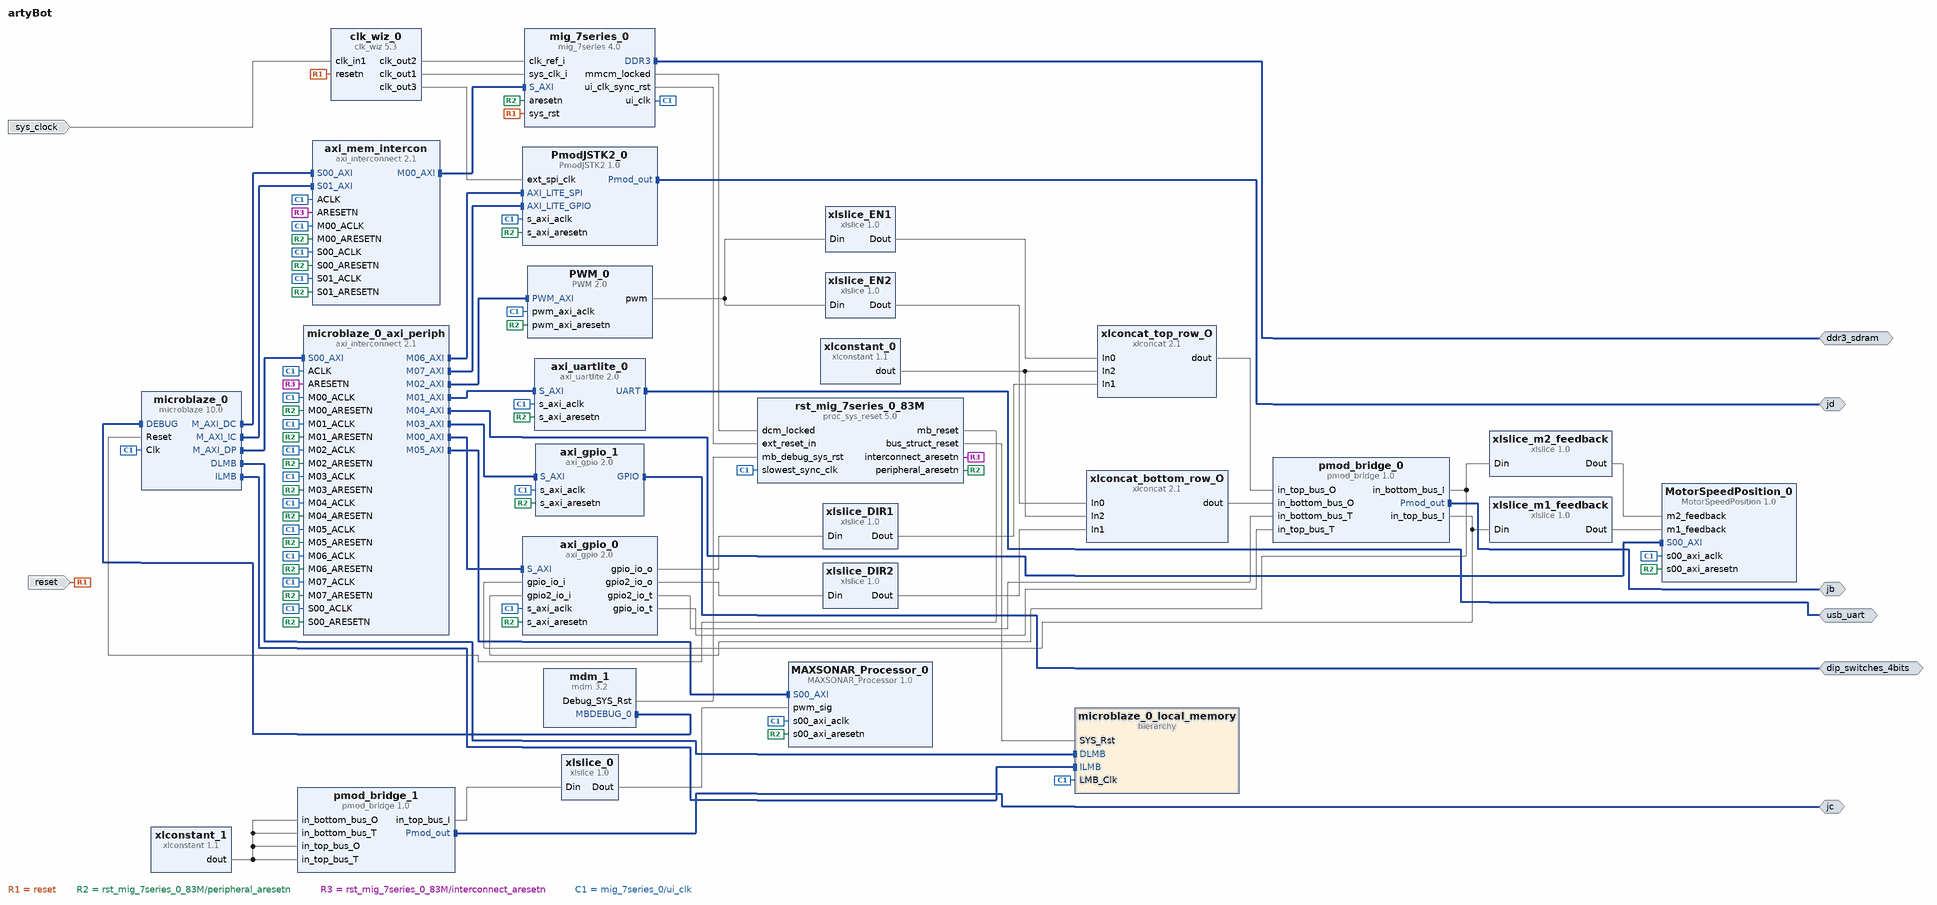
[diagram p0: block diagram of the top level]
# Vivado block design artyBot, xc7a35ticsg324-1L, Vivado 2016.4
create_bd_design artyBot

create_bd_intf_port -mode Master -vlnv xilinx.com:interface:ddrx_rtl:1.0 ddr3_sdram
create_bd_intf_port -mode Master -vlnv xilinx.com:interface:uart_rtl:1.0 usb_uart
create_bd_intf_port -mode Master -vlnv xilinx.com:interface:gpio_rtl:1.0 dip_switches_4bits
create_bd_intf_port -mode Master -vlnv digilentinc.com:interface:pmod_rtl:1.0 jb
create_bd_intf_port -mode Master -vlnv digilentinc.com:interface:pmod_rtl:1.0 jc
create_bd_intf_port -mode Master -vlnv digilentinc.com:interface:pmod_rtl:1.0 jd
create_bd_port -dir I -type rst reset
set_property -dict {CONFIG.POLARITY ACTIVE_LOW} [get_bd_ports reset]
create_bd_port -dir I -type clk sys_clock
set_property -dict {CONFIG.FREQ_HZ 100000000 CONFIG.PHASE 0.000} [get_bd_ports sys_clock]

create_bd_cell -type ip -vlnv xilinx.com:ip:mig_7series:4.0 mig_7series_0
set_property -dict {CONFIG.RESET_BOARD_INTERFACE reset CONFIG.BOARD_MIG_PARAM ddr3_sdram} [get_bd_cells mig_7series_0]
create_bd_cell -type ip -vlnv xilinx.com:ip:microblaze:10.0 microblaze_0
set_property -dict [list \
  CONFIG.C_D_AXI 1 \
  CONFIG.C_D_LMB 1 \
  CONFIG.C_I_LMB 1 \
  CONFIG.C_DEBUG_ENABLED 1 \
  CONFIG.C_USE_ICACHE 1 \
  CONFIG.C_CACHE_BYTE_SIZE 16384 \
  CONFIG.C_USE_DCACHE 1 \
  CONFIG.C_DCACHE_BYTE_SIZE 16384 \
] [get_bd_cells microblaze_0]
create_bd_cell -type hier microblaze_0_local_memory
create_bd_cell -type ip -vlnv xilinx.com:ip:mdm:3.2 mdm_1
create_bd_cell -type ip -vlnv xilinx.com:ip:proc_sys_reset:5.0 rst_mig_7series_0_83M
create_bd_cell -type ip -vlnv xilinx.com:ip:axi_interconnect:2.1 axi_mem_intercon
set_property -dict {CONFIG.NUM_SI 2 CONFIG.NUM_MI 1} [get_bd_cells axi_mem_intercon]
create_bd_cell -type ip -vlnv xilinx.com:ip:axi_interconnect:2.1 microblaze_0_axi_periph
set_property -dict {CONFIG.NUM_MI 8} [get_bd_cells microblaze_0_axi_periph]
create_bd_cell -type ip -vlnv xilinx.com:ip:axi_uartlite:2.0 axi_uartlite_0
set_property -dict {CONFIG.USE_BOARD_FLOW true CONFIG.UARTLITE_BOARD_INTERFACE usb_uart} [get_bd_cells axi_uartlite_0]
create_bd_cell -type ip -vlnv xilinx.com:ip:clk_wiz:5.3 clk_wiz_0
set_property -dict [list \
  CONFIG.CLKOUT2_USED true \
  CONFIG.CLKOUT3_USED true \
  CONFIG.NUM_OUT_CLKS 3 \
  CONFIG.CLKOUT1_REQUESTED_OUT_FREQ 166.667 \
  CONFIG.CLKOUT2_REQUESTED_OUT_FREQ 200 \
  CONFIG.CLKOUT3_REQUESTED_OUT_FREQ 16.000 \
  CONFIG.RESET_PORT resetn \
  CONFIG.MMCM_DIVCLK_DIVIDE 1 \
  CONFIG.MMCM_CLKOUT0_DIVIDE_F 6.000 \
  CONFIG.MMCM_CLKOUT1_DIVIDE 5 \
  CONFIG.MMCM_CLKOUT2_DIVIDE 63 \
  CONFIG.RESET_TYPE ACTIVE_LOW \
  CONFIG.USE_BOARD_FLOW true \
  CONFIG.CLK_IN1_BOARD_INTERFACE sys_clock \
  CONFIG.RESET_BOARD_INTERFACE reset \
  CONFIG.CLKOUT1_JITTER 118.758 \
  CONFIG.CLKOUT2_JITTER 114.829 \
  CONFIG.CLKOUT2_PHASE_ERROR 98.575 \
  CONFIG.CLKOUT3_JITTER 191.683 \
  CONFIG.CLKOUT3_PHASE_ERROR 98.575 \
] [get_bd_cells clk_wiz_0]
create_bd_cell -type ip -vlnv xilinx.com:ip:axi_gpio:2.0 axi_gpio_1
set_property -dict {CONFIG.USE_BOARD_FLOW true CONFIG.GPIO_BOARD_INTERFACE dip_switches_4bits} [get_bd_cells axi_gpio_1]
create_bd_cell -type ip -vlnv xilinx.com:ip:xlconcat:2.1 xlconcat_top_row_O
set_property -dict {CONFIG.NUM_PORTS 3 CONFIG.IN0_WIDTH 1 CONFIG.IN1_WIDTH 1 CONFIG.IN2_WIDTH 2} [get_bd_cells xlconcat_top_row_O]
create_bd_cell -type ip -vlnv xilinx.com:ip:xlslice:1.0 xlslice_EN1
set_property -dict {CONFIG.DOUT_WIDTH 1 CONFIG.DIN_TO 0 CONFIG.DIN_FROM 0 CONFIG.DIN_WIDTH 2} [get_bd_cells xlslice_EN1]
create_bd_cell -type ip -vlnv xilinx.com:ip:xlslice:1.0 xlslice_EN2
set_property -dict {CONFIG.DOUT_WIDTH 1 CONFIG.DIN_TO 1 CONFIG.DIN_FROM 1 CONFIG.DIN_WIDTH 2} [get_bd_cells xlslice_EN2]
create_bd_cell -type ip -vlnv xilinx.com:ip:xlconcat:2.1 xlconcat_bottom_row_O
set_property -dict [list \
  CONFIG.NUM_PORTS 3 \
  CONFIG.IN0_WIDTH 1 \
  CONFIG.IN1_WIDTH 1 \
  CONFIG.IN2_WIDTH 2 \
] [get_bd_cells xlconcat_bottom_row_O]
create_bd_cell -type ip -vlnv xilinx.com:ip:xlslice:1.0 xlslice_DIR2
set_property -dict {CONFIG.DIN_TO 0 CONFIG.DIN_FROM 0 CONFIG.DIN_WIDTH 4} [get_bd_cells xlslice_DIR2]
create_bd_cell -type ip -vlnv xilinx.com:ip:xlslice:1.0 xlslice_DIR1
set_property -dict {CONFIG.DIN_TO 0 CONFIG.DIN_FROM 0 CONFIG.DIN_WIDTH 4} [get_bd_cells xlslice_DIR1]
create_bd_cell -type ip -vlnv xilinx.com:ip:xlconstant:1.1 xlconstant_0
set_property -dict {CONFIG.CONST_WIDTH 2 CONFIG.CONST_VAL 0} [get_bd_cells xlconstant_0]
create_bd_cell -type ip -vlnv xilinx.com:ip:xlslice:1.0 xlslice_m1_feedback
set_property -dict {CONFIG.DOUT_WIDTH 1 CONFIG.DIN_TO 2 CONFIG.DIN_FROM 2 CONFIG.DIN_WIDTH 4} [get_bd_cells xlslice_m1_feedback]
create_bd_cell -type ip -vlnv xilinx.com:ip:xlslice:1.0 xlslice_m2_feedback
set_property -dict {CONFIG.DOUT_WIDTH 1 CONFIG.DIN_TO 2 CONFIG.DIN_FROM 2 CONFIG.DIN_WIDTH 4} [get_bd_cells xlslice_m2_feedback]
create_bd_cell -type ip -vlnv xilinx.com:ip:xlconstant:1.1 xlconstant_1
set_property -dict {CONFIG.CONST_WIDTH 4 CONFIG.CONST_VAL 15} [get_bd_cells xlconstant_1]
create_bd_cell -type ip -vlnv natinst.com:user:MotorSpeedPosition:1.0 MotorSpeedPosition_0
create_bd_cell -type ip -vlnv digilentinc.com:IP:PWM:2.0 PWM_0
set_property -dict {CONFIG.NUM_PWM 2} [get_bd_cells PWM_0]
create_bd_cell -type ip -vlnv digilentinc.com:ip:pmod_bridge:1.0 pmod_bridge_0
set_property -dict [list \
  CONFIG.Top_Row_Interface GPIO \
  CONFIG.Bottom_Row_Interface GPIO \
  CONFIG.PMOD jb \
  CONFIG.USE_BOARD_FLOW true \
] [get_bd_cells pmod_bridge_0]
create_bd_cell -type ip -vlnv xilinx.com:ip:xlslice:1.0 xlslice_0
set_property -dict {CONFIG.DOUT_WIDTH 1 CONFIG.DIN_TO 3 CONFIG.DIN_FROM 3 CONFIG.DIN_WIDTH 4} [get_bd_cells xlslice_0]
create_bd_cell -type ip -vlnv xilinx.com:ip:axi_gpio:2.0 axi_gpio_0
set_property -dict {CONFIG.C_GPIO_WIDTH 4 CONFIG.C_GPIO2_WIDTH 4 CONFIG.C_IS_DUAL 1} [get_bd_cells axi_gpio_0]
create_bd_cell -type ip -vlnv digilentinc.com:ip:pmod_bridge:1.0 pmod_bridge_1
set_property -dict [list \
  CONFIG.Top_Row_Interface GPIO \
  CONFIG.Bottom_Row_Interface GPIO \
  CONFIG.PMOD jc \
  CONFIG.USE_BOARD_FLOW true \
] [get_bd_cells pmod_bridge_1]
create_bd_cell -type ip -vlnv natinst.com:user:MAXSONAR_Processor:1.0 MAXSONAR_Processor_0
create_bd_cell -type ip -vlnv digilentinc.com:IP:PmodJSTK2:1.0 PmodJSTK2_0
set_property -dict {CONFIG.PMOD jd CONFIG.USE_BOARD_FLOW true} [get_bd_cells PmodJSTK2_0]

# ---- hierarchy /microblaze_0_local_memory ----
current_bd_instance /microblaze_0_local_memory
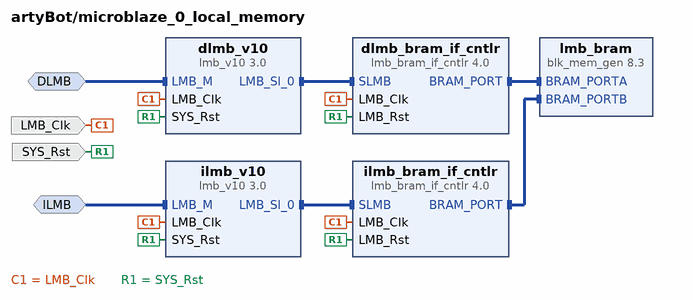
[diagram p1: block diagram inside /microblaze_0_local_memory]
create_bd_intf_pin -mode MirroredMaster -vlnv xilinx.com:interface:lmb_rtl:1.0 DLMB
create_bd_intf_pin -mode MirroredMaster -vlnv xilinx.com:interface:lmb_rtl:1.0 ILMB
create_bd_pin -dir I -type clk LMB_Clk
create_bd_pin -dir I -type rst SYS_Rst

create_bd_cell -type ip -vlnv xilinx.com:ip:lmb_v10:3.0 dlmb_v10
create_bd_cell -type ip -vlnv xilinx.com:ip:lmb_v10:3.0 ilmb_v10
create_bd_cell -type ip -vlnv xilinx.com:ip:lmb_bram_if_cntlr:4.0 dlmb_bram_if_cntlr
set_property -dict {CONFIG.C_ECC 0} [get_bd_cells dlmb_bram_if_cntlr]
create_bd_cell -type ip -vlnv xilinx.com:ip:lmb_bram_if_cntlr:4.0 ilmb_bram_if_cntlr
set_property -dict {CONFIG.C_ECC 0} [get_bd_cells ilmb_bram_if_cntlr]
create_bd_cell -type ip -vlnv xilinx.com:ip:blk_mem_gen:8.3 lmb_bram
set_property -dict {CONFIG.Memory_Type True_Dual_Port_RAM CONFIG.use_bram_block BRAM_Controller} [get_bd_cells lmb_bram]

# ---- connections ----

current_bd_instance /microblaze_0_local_memory
connect_bd_intf_net -intf_net microblaze_0_dlmb_bus [get_bd_intf_pins dlmb_v10/LMB_Sl_0] [get_bd_intf_pins dlmb_bram_if_cntlr/SLMB]
connect_bd_intf_net -intf_net microblaze_0_ilmb_bus [get_bd_intf_pins ilmb_v10/LMB_Sl_0] [get_bd_intf_pins ilmb_bram_if_cntlr/SLMB]
connect_bd_intf_net -intf_net microblaze_0_dlmb_cntlr [get_bd_intf_pins dlmb_bram_if_cntlr/BRAM_PORT] [get_bd_intf_pins lmb_bram/BRAM_PORTA]
connect_bd_intf_net -intf_net microblaze_0_ilmb_cntlr [get_bd_intf_pins ilmb_bram_if_cntlr/BRAM_PORT] [get_bd_intf_pins lmb_bram/BRAM_PORTB]
connect_bd_intf_net -intf_net microblaze_0_dlmb [get_bd_intf_pins DLMB] [get_bd_intf_pins dlmb_v10/LMB_M]
connect_bd_intf_net -intf_net microblaze_0_ilmb [get_bd_intf_pins ILMB] [get_bd_intf_pins ilmb_v10/LMB_M]
connect_bd_net -net microblaze_0_Clk [get_bd_pins LMB_Clk] \
  [get_bd_pins dlmb_v10/LMB_Clk] [get_bd_pins dlmb_bram_if_cntlr/LMB_Clk] [get_bd_pins ilmb_v10/LMB_Clk] \
  [get_bd_pins ilmb_bram_if_cntlr/LMB_Clk]
connect_bd_net [get_bd_pins SYS_Rst] \
  [get_bd_pins dlmb_v10/SYS_Rst] [get_bd_pins dlmb_bram_if_cntlr/LMB_Rst] [get_bd_pins ilmb_v10/SYS_Rst] \
  [get_bd_pins ilmb_bram_if_cntlr/LMB_Rst]

current_bd_instance /
connect_bd_intf_net [get_bd_intf_pins microblaze_0/DLMB] [get_bd_intf_pins microblaze_0_local_memory/DLMB]
connect_bd_intf_net [get_bd_intf_pins microblaze_0/ILMB] [get_bd_intf_pins microblaze_0_local_memory/ILMB]
connect_bd_intf_net [get_bd_intf_pins mdm_1/MBDEBUG_0] [get_bd_intf_pins microblaze_0/DEBUG]
connect_bd_intf_net [get_bd_intf_pins microblaze_0/M_AXI_DC] [get_bd_intf_pins axi_mem_intercon/S00_AXI]
connect_bd_intf_net [get_bd_intf_pins microblaze_0/M_AXI_IC] [get_bd_intf_pins axi_mem_intercon/S01_AXI]
connect_bd_intf_net [get_bd_intf_pins microblaze_0/M_AXI_DP] [get_bd_intf_pins microblaze_0_axi_periph/S00_AXI]
connect_bd_intf_net [get_bd_intf_pins axi_mem_intercon/M00_AXI] [get_bd_intf_pins mig_7series_0/S_AXI]
connect_bd_intf_net [get_bd_intf_pins microblaze_0_axi_periph/M01_AXI] [get_bd_intf_pins axi_uartlite_0/S_AXI]
connect_bd_intf_net [get_bd_intf_pins microblaze_0_axi_periph/M02_AXI] [get_bd_intf_pins PWM_0/PWM_AXI]
connect_bd_intf_net [get_bd_intf_pins microblaze_0_axi_periph/M03_AXI] [get_bd_intf_pins axi_gpio_1/S_AXI]
connect_bd_intf_net [get_bd_intf_pins microblaze_0_axi_periph/M04_AXI] [get_bd_intf_pins MotorSpeedPosition_0/S00_AXI]
connect_bd_intf_net [get_bd_intf_pins microblaze_0_axi_periph/M05_AXI] [get_bd_intf_pins MAXSONAR_Processor_0/S00_AXI]
connect_bd_intf_net [get_bd_intf_pins microblaze_0_axi_periph/M00_AXI] [get_bd_intf_pins axi_gpio_0/S_AXI]
connect_bd_intf_net [get_bd_intf_pins microblaze_0_axi_periph/M06_AXI] [get_bd_intf_pins PmodJSTK2_0/AXI_LITE_SPI]
connect_bd_intf_net [get_bd_intf_pins microblaze_0_axi_periph/M07_AXI] [get_bd_intf_pins PmodJSTK2_0/AXI_LITE_GPIO]
connect_bd_intf_net [get_bd_intf_ports ddr3_sdram] [get_bd_intf_pins mig_7series_0/DDR3]
connect_bd_intf_net [get_bd_intf_ports usb_uart] [get_bd_intf_pins axi_uartlite_0/UART]
connect_bd_intf_net [get_bd_intf_ports dip_switches_4bits] [get_bd_intf_pins axi_gpio_1/GPIO]
connect_bd_intf_net [get_bd_intf_ports jb] [get_bd_intf_pins pmod_bridge_0/Pmod_out]
connect_bd_intf_net [get_bd_intf_ports jc] [get_bd_intf_pins pmod_bridge_1/Pmod_out]
connect_bd_intf_net [get_bd_intf_ports jd] [get_bd_intf_pins PmodJSTK2_0/Pmod_out]
connect_bd_net [get_bd_ports reset] [get_bd_pins mig_7series_0/sys_rst] [get_bd_pins clk_wiz_0/resetn]
connect_bd_net [get_bd_pins mig_7series_0/mmcm_locked] [get_bd_pins rst_mig_7series_0_83M/dcm_locked]
connect_bd_net [get_bd_pins mig_7series_0/ui_clk_sync_rst] [get_bd_pins rst_mig_7series_0_83M/ext_reset_in]
connect_bd_net [get_bd_pins rst_mig_7series_0_83M/mb_reset] [get_bd_pins microblaze_0/Reset]
connect_bd_net [get_bd_pins rst_mig_7series_0_83M/bus_struct_reset] [get_bd_pins microblaze_0_local_memory/SYS_Rst]
connect_bd_net [get_bd_pins mdm_1/Debug_SYS_Rst] [get_bd_pins rst_mig_7series_0_83M/mb_debug_sys_rst]
connect_bd_net [get_bd_pins rst_mig_7series_0_83M/peripheral_aresetn] \
  [get_bd_pins mig_7series_0/aresetn] [get_bd_pins axi_uartlite_0/s_axi_aresetn] [get_bd_pins axi_gpio_1/s_axi_aresetn] \
  [get_bd_pins MotorSpeedPosition_0/s00_axi_aresetn] [get_bd_pins PWM_0/pwm_axi_aresetn] \
  [get_bd_pins axi_gpio_0/s_axi_aresetn] [get_bd_pins MAXSONAR_Processor_0/s00_axi_aresetn] \
  [get_bd_pins axi_mem_intercon/S00_ARESETN] [get_bd_pins axi_mem_intercon/S01_ARESETN] \
  [get_bd_pins axi_mem_intercon/M00_ARESETN] [get_bd_pins microblaze_0_axi_periph/S00_ARESETN] \
  [get_bd_pins microblaze_0_axi_periph/M00_ARESETN] [get_bd_pins microblaze_0_axi_periph/M01_ARESETN] \
  [get_bd_pins microblaze_0_axi_periph/M02_ARESETN] [get_bd_pins microblaze_0_axi_periph/M03_ARESETN] \
  [get_bd_pins microblaze_0_axi_periph/M04_ARESETN] [get_bd_pins microblaze_0_axi_periph/M05_ARESETN] \
  [get_bd_pins microblaze_0_axi_periph/M06_ARESETN] [get_bd_pins microblaze_0_axi_periph/M07_ARESETN] \
  [get_bd_pins PmodJSTK2_0/s_axi_aresetn]
connect_bd_net [get_bd_pins rst_mig_7series_0_83M/interconnect_aresetn] \
  [get_bd_pins axi_mem_intercon/ARESETN] [get_bd_pins microblaze_0_axi_periph/ARESETN]
connect_bd_net [get_bd_pins clk_wiz_0/clk_out2] [get_bd_pins mig_7series_0/clk_ref_i]
connect_bd_net -net microblaze_0_Clk [get_bd_pins clk_wiz_0/clk_out1] [get_bd_pins mig_7series_0/sys_clk_i]
connect_bd_net -net microblaze_0_Clk_2 [get_bd_pins mig_7series_0/ui_clk] \
  [get_bd_pins microblaze_0/Clk] [get_bd_pins rst_mig_7series_0_83M/slowest_sync_clk] [get_bd_pins axi_uartlite_0/s_axi_aclk] \
  [get_bd_pins axi_gpio_1/s_axi_aclk] [get_bd_pins MotorSpeedPosition_0/s00_axi_aclk] [get_bd_pins PWM_0/pwm_axi_aclk] \
  [get_bd_pins axi_gpio_0/s_axi_aclk] [get_bd_pins MAXSONAR_Processor_0/s00_axi_aclk] \
  [get_bd_pins microblaze_0_local_memory/LMB_Clk] [get_bd_pins axi_mem_intercon/S00_ACLK] [get_bd_pins axi_mem_intercon/ACLK] \
  [get_bd_pins axi_mem_intercon/S01_ACLK] [get_bd_pins axi_mem_intercon/M00_ACLK] \
  [get_bd_pins microblaze_0_axi_periph/S00_ACLK] [get_bd_pins microblaze_0_axi_periph/ACLK] \
  [get_bd_pins microblaze_0_axi_periph/M00_ACLK] [get_bd_pins microblaze_0_axi_periph/M01_ACLK] \
  [get_bd_pins microblaze_0_axi_periph/M02_ACLK] [get_bd_pins microblaze_0_axi_periph/M03_ACLK] \
  [get_bd_pins microblaze_0_axi_periph/M04_ACLK] [get_bd_pins microblaze_0_axi_periph/M05_ACLK] \
  [get_bd_pins microblaze_0_axi_periph/M06_ACLK] [get_bd_pins microblaze_0_axi_periph/M07_ACLK] \
  [get_bd_pins PmodJSTK2_0/s_axi_aclk]
connect_bd_net [get_bd_pins PWM_0/pwm] [get_bd_pins xlslice_EN1/Din] [get_bd_pins xlslice_EN2/Din]
connect_bd_net -net xlslice_0_Dout [get_bd_pins xlslice_EN1/Dout] [get_bd_pins xlconcat_top_row_O/In0]
connect_bd_net -net xlslice_1_EN2_Dout [get_bd_pins xlslice_EN2/Dout] [get_bd_pins xlconcat_bottom_row_O/In0]
connect_bd_net -net xlconcat_0_top_row_O_dout [get_bd_pins xlconcat_top_row_O/dout] [get_bd_pins pmod_bridge_0/in_top_bus_O]
connect_bd_net -net xlconcat_1_bottom_row_O_dout [get_bd_pins xlconcat_bottom_row_O/dout] [get_bd_pins pmod_bridge_0/in_bottom_bus_O]
connect_bd_net [get_bd_pins xlslice_DIR1/Dout] [get_bd_pins xlconcat_top_row_O/In1]
connect_bd_net [get_bd_pins xlslice_DIR2/Dout] [get_bd_pins xlconcat_bottom_row_O/In1]
connect_bd_net [get_bd_pins xlconstant_0/dout] [get_bd_pins xlconcat_top_row_O/In2] [get_bd_pins xlconcat_bottom_row_O/In2]
connect_bd_net [get_bd_pins pmod_bridge_0/in_top_bus_I] [get_bd_pins xlslice_m1_feedback/Din] [get_bd_pins axi_gpio_0/gpio_io_i]
connect_bd_net [get_bd_pins pmod_bridge_0/in_bottom_bus_I] [get_bd_pins xlslice_m2_feedback/Din] [get_bd_pins axi_gpio_0/gpio2_io_i]
connect_bd_net [get_bd_pins xlslice_m1_feedback/Dout] [get_bd_pins MotorSpeedPosition_0/m1_feedback]
connect_bd_net [get_bd_pins xlslice_m2_feedback/Dout] [get_bd_pins MotorSpeedPosition_0/m2_feedback]
connect_bd_net [get_bd_ports sys_clock] [get_bd_pins clk_wiz_0/clk_in1]
connect_bd_net [get_bd_pins xlslice_0/Dout] [get_bd_pins MAXSONAR_Processor_0/pwm_sig]
connect_bd_net [get_bd_pins axi_gpio_0/gpio2_io_t] [get_bd_pins pmod_bridge_0/in_bottom_bus_T]
connect_bd_net [get_bd_pins axi_gpio_0/gpio2_io_o] [get_bd_pins xlslice_DIR2/Din]
connect_bd_net [get_bd_pins axi_gpio_0/gpio_io_t] [get_bd_pins pmod_bridge_0/in_top_bus_T]
connect_bd_net [get_bd_pins axi_gpio_0/gpio_io_o] [get_bd_pins xlslice_DIR1/Din]
connect_bd_net [get_bd_pins pmod_bridge_1/in_top_bus_I] [get_bd_pins xlslice_0/Din]
connect_bd_net [get_bd_pins xlconstant_1/dout] \
  [get_bd_pins pmod_bridge_1/in_bottom_bus_O] [get_bd_pins pmod_bridge_1/in_top_bus_T] \
  [get_bd_pins pmod_bridge_1/in_top_bus_O] [get_bd_pins pmod_bridge_1/in_bottom_bus_T]
connect_bd_net [get_bd_pins clk_wiz_0/clk_out3] [get_bd_pins PmodJSTK2_0/ext_spi_clk]

# ---- address map ----
assign_bd_address -offset 0x00000000 -range 64K -target_address_space [get_bd_addr_spaces microblaze_0/Data] [get_bd_addr_segs microblaze_0_local_memory/dlmb_bram_if_cntlr/SLMB/Mem]
assign_bd_address -offset 0x00010000 -range 64K -target_address_space [get_bd_addr_spaces microblaze_0/Data] [get_bd_addr_segs PmodJSTK2_0/AXI_LITE_SPI/Reg0]
assign_bd_address -offset 0x00020000 -range 4K -target_address_space [get_bd_addr_spaces microblaze_0/Data] [get_bd_addr_segs PmodJSTK2_0/AXI_LITE_GPIO/Reg0]
assign_bd_address -offset 0x40000000 -range 64K -target_address_space [get_bd_addr_spaces microblaze_0/Data] [get_bd_addr_segs axi_gpio_0/S_AXI/Reg]
assign_bd_address -offset 0x40010000 -range 64K -target_address_space [get_bd_addr_spaces microblaze_0/Data] [get_bd_addr_segs axi_gpio_1/S_AXI/Reg]
assign_bd_address -offset 0x40600000 -range 64K -target_address_space [get_bd_addr_spaces microblaze_0/Data] [get_bd_addr_segs axi_uartlite_0/S_AXI/Reg]
assign_bd_address -offset 0x44A00000 -range 64K -target_address_space [get_bd_addr_spaces microblaze_0/Data] [get_bd_addr_segs PWM_0/PWM_AXI/PWM_AXI_reg]
assign_bd_address -offset 0x44A10000 -range 64K -target_address_space [get_bd_addr_spaces microblaze_0/Data] [get_bd_addr_segs MotorSpeedPosition_0/S00_AXI/S00_AXI_reg]
assign_bd_address -offset 0x44A20000 -range 64K -target_address_space [get_bd_addr_spaces microblaze_0/Data] [get_bd_addr_segs MAXSONAR_Processor_0/S00_AXI/S00_AXI_reg]
assign_bd_address -offset 0x80000000 -range 256M -target_address_space [get_bd_addr_spaces microblaze_0/Data] [get_bd_addr_segs mig_7series_0/memmap/memaddr]
assign_bd_address -offset 0x00000000 -range 64K -target_address_space [get_bd_addr_spaces microblaze_0/Instruction] [get_bd_addr_segs microblaze_0_local_memory/ilmb_bram_if_cntlr/SLMB/Mem]
assign_bd_address -offset 0x80000000 -range 256M -target_address_space [get_bd_addr_spaces microblaze_0/Instruction] [get_bd_addr_segs mig_7series_0/memmap/memaddr]

validate_bd_design
save_bd_design
